# Altium schematic sheet 3-Peripheral.SchDoc
size A3; DocumentNumber: 3; SheetNumber: 3; SheetTotal: 7
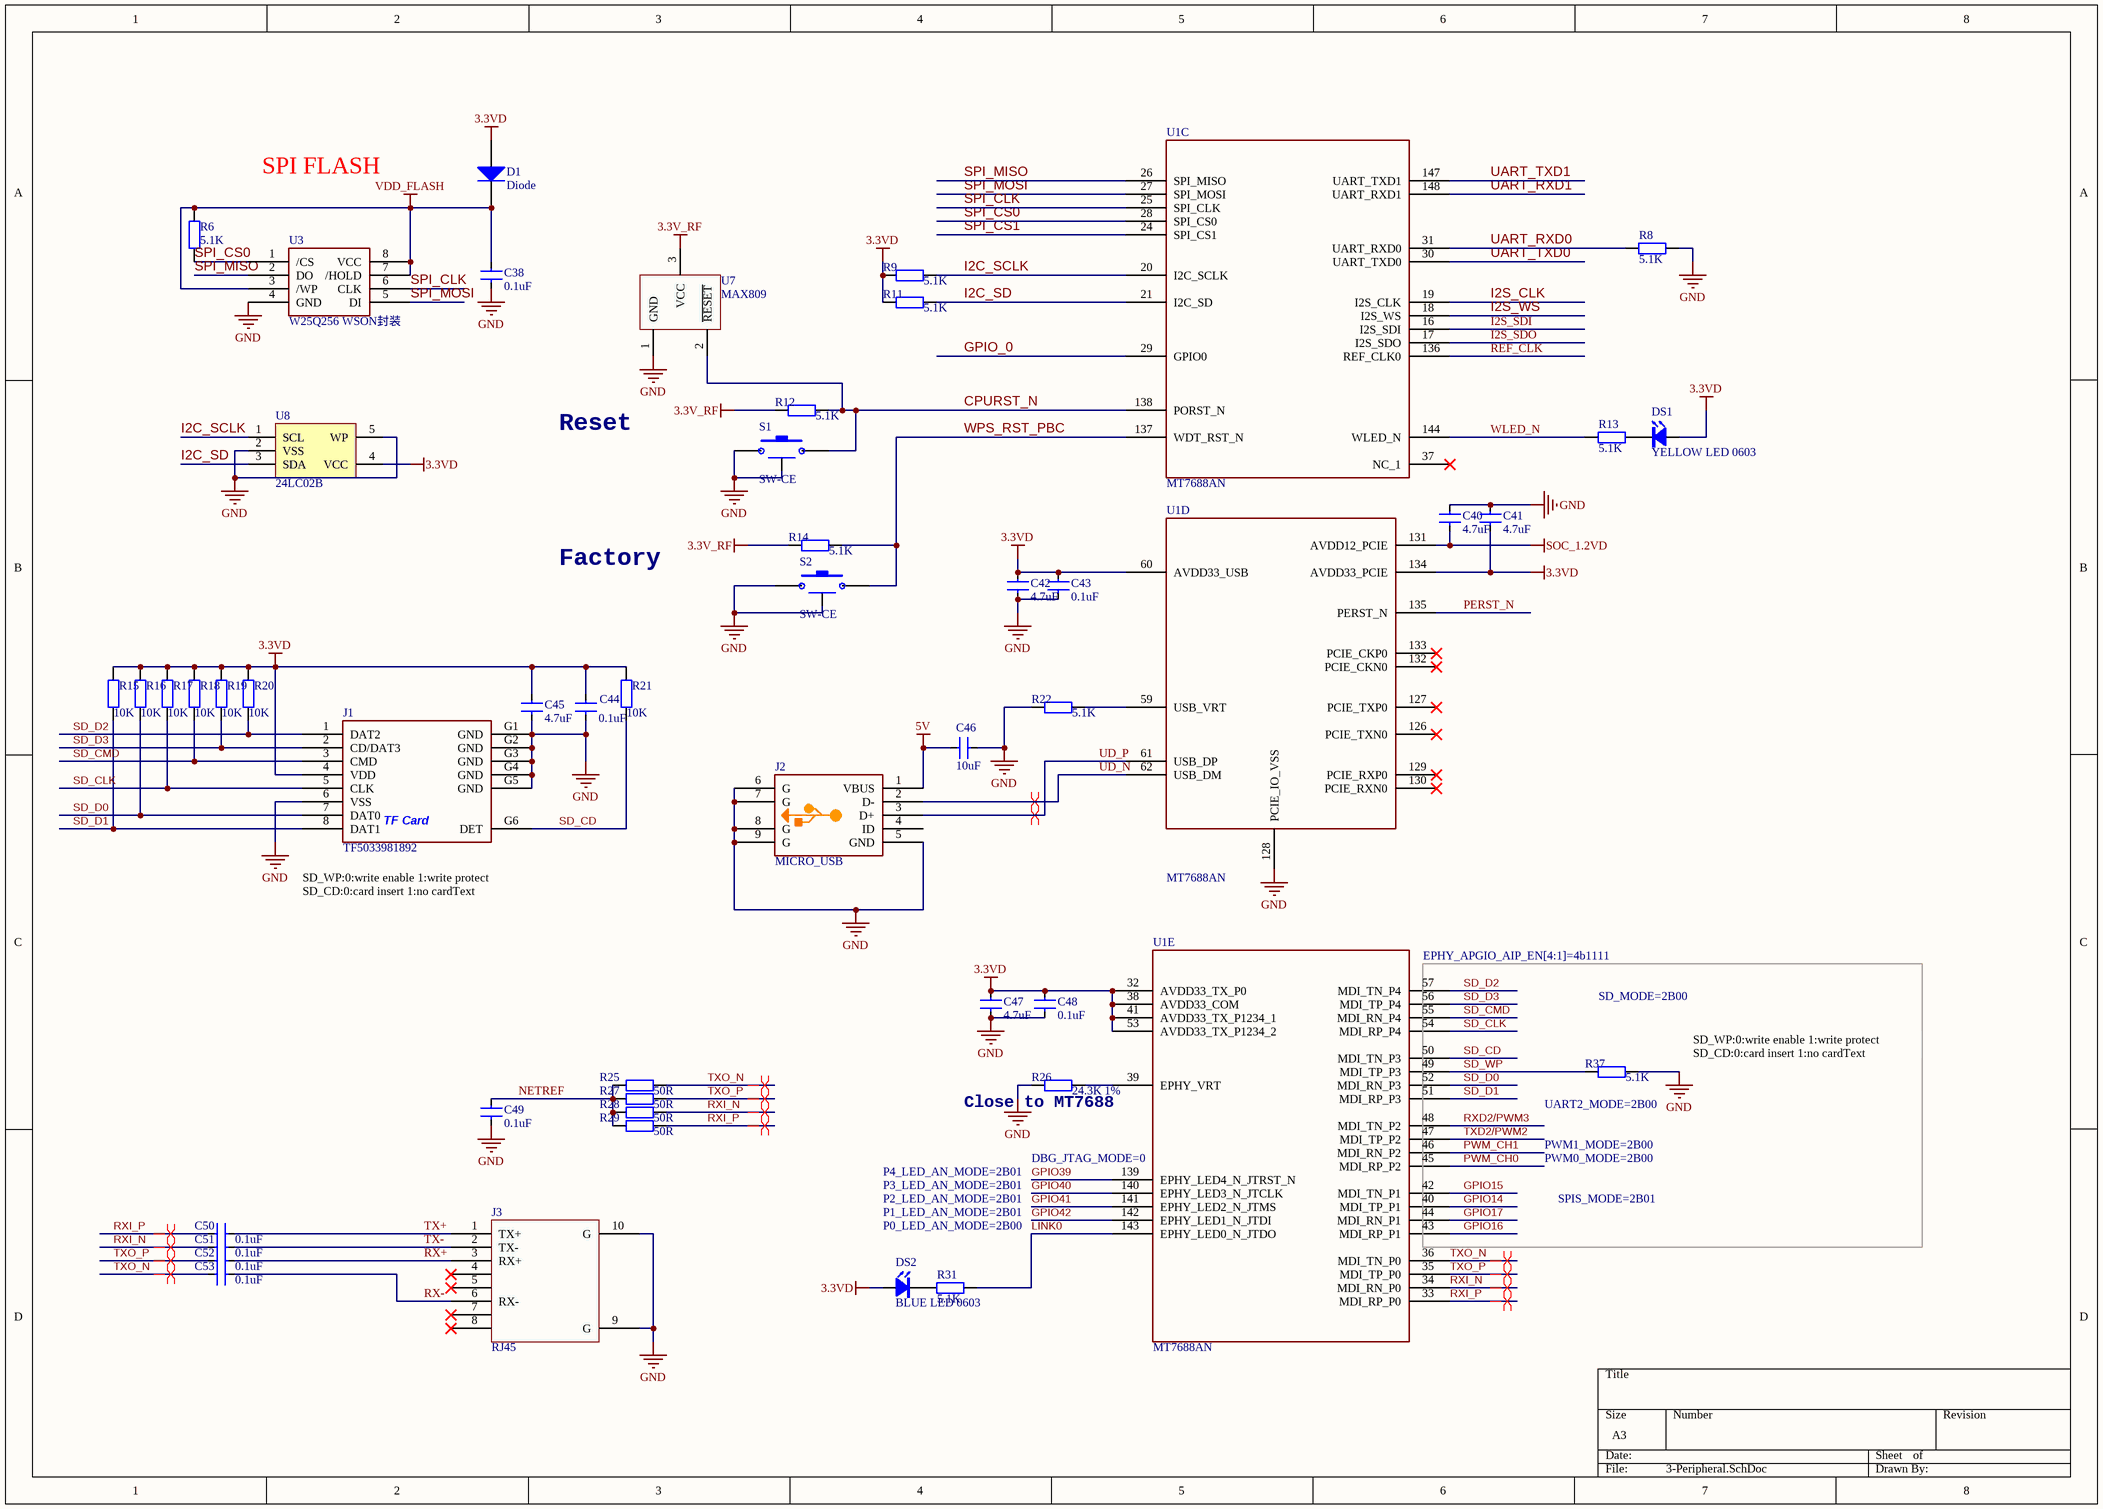
[diagram p0: 3-Peripheral.SchDoc]

## Parts
C38  0.1uF  [C0402]
C40  4.7uF  [C0402]
C41  4.7uF  [C0402]
C42  4.7uF  [C0402]
C43  0.1uF  [C0402]
C44  0.1uF  [C0402]
C45  4.7uF  [C0402]
C46  10uF  [0805C]
C47  4.7uF  [C0402]
C48  0.1uF  [C0402]
C49  0.1uF  [C0402]
C50  0.1uF  [C0402]
C51  0.1uF  [C0402]
C52  0.1uF  [C0402]
C53  0.1uF  [C0402]
D1  Diode  [SOD723]
DS1  YELLOW LED 0603  [LED0603]
DS2  BLUE LED 0603  [LED0603]
J1  TF5033981892  [TFCARD]
J2  MICRO_USB  [MICROUSB]
J3  RJ45  [RJ45]
R6  5.1K  [R0402]
R8  5.1K  [R0402]
R9  5.1K  [R0402]
R11  5.1K  [R0402]
R12  5.1K  [R0402]
R13  5.1K  [R0402]
R14  5.1K  [R0402]
R15  10K  [R0402]
R16  10K  [R0402]
R17  10K  [R0402]
R18  10K  [R0402]
R19  10K  [R0402]
R20  10K  [R0402]
R21  10K  [R0402]
R22  5.1K  [R0402]
R25  50R  [R0402]
R26  24.3K 1%  [R0402]
R27  50R  [R0402]
R28  50R  [R0402]
R29  50R  [R0402]
R31  5.1K  [R0402]
R37  5.1K  [R0402]
S1  SW-CE  [KEY-A06]
S2  SW-CE  [KEY-A06]
U1  MT7688AN  [MT7628AN/DRQFN156/SMD/P0.5/12X12]  (parts C,D,E of 6)
U3  W25Q256 WSON封装  [WSON-SPIFLASH]
U7  MAX809  [SOT23]
U8  24LC02B  [SOT23-5]

## Nets
3.3V_RF: R12.2 R14.2 U7.3(VCC)
3.3VD: C41.2 C42.1 C43.1 C44.1 C45.1 C47.1 C48.1 D1.A DS1.A DS2.A J1.4(VDD) R9.2 R11.2 R15.1 R16.1 R17.1 R18.1 R19.1 R20.1 R21.1 U1.32(AVDD33_TX_P0) U1.38(AVDD33_COM) U1.41(AVDD33_TX_P1234_1) U1.53(AVDD33_TX_P1234_2) U1.60(AVDD33_USB) U1.134(AVDD33_PCIE) U8.4(VCC)
5V: C46.1 J2.1(VBUS)
GND: C38.1 C40.1 C41.1 C42.2 C43.2 C44.2 C45.2 C46.2 C47.2 C48.2 C49.1 J1.6(VSS) J1.G1(GND) J1.G2(GND) J1.G3(GND) J1.G4(GND) J1.G5(GND) J2.5(GND) J2.6(G) J2.7(G) J2.8(G) J2.9(G) J3.9(G) J3.10(G) R8.1 R22.2 R26.2 R37.1 S1.0 S1.2 S2.0 S2.1 U1.128(PCIE_IO_VSS) U3.4(GND) U7.1(GND) U8.2(VSS) U8.5(WP)
SOC_1.2VD: C40.2 U1.131(AVDD12_PCIE)
VDD_FLASH: C38.2 D1.K R6.1 U3.3(/WP) U3.7(/HOLD) U3.8(VCC)
CPURST_N: R12.1 S1.1 U1.138(PORST_N) U7.2(~{RESET})
GPIO14: U1.40(MDI_TP_P1)
GPIO15: U1.42(MDI_TN_P1)
GPIO16: U1.43(MDI_RP_P1)
GPIO17: U1.44(MDI_RN_P1)
GPIO39: U1.139(EPHY_LED4_N_JTRST_N)
GPIO40: U1.140(EPHY_LED3_N_JTCLK)
GPIO41: U1.141(EPHY_LED2_N_JTMS)
GPIO42: U1.142(EPHY_LED1_N_JTDI)
GPIO_0: U1.29(GPIO0)
I2C_SCLK: R9.1 U1.20(I2C_SCLK) U8.1(SCL)
I2C_SD: R11.1 U1.21(I2C_SD) U8.3(SDA)
I2S_CLK: U1.19(I2S_CLK)
I2S_SDI: U1.16(I2S_SDI)
I2S_SDO: U1.17(I2S_SDO)
I2S_WS: U1.18(I2S_WS)
LINK0: R31.2 U1.143(EPHY_LED0_N_JTDO)
NETREF: C49.2 R25.2 R27.2 R28.2 R29.2
PERST_N: U1.135(PERST_N)
PWM_CH0: U1.45(MDI_RP_P2)
PWM_CH1: U1.46(MDI_RN_P2)
REF_CLK: U1.136(REF_CLK0)
RX+: C52.2 J3.3(RX+)
RX-: C53.2 J3.6(RX-)
RXD2/PWM3: U1.48(MDI_TN_P2)
RXI_N: C51.1 R28.1 U1.34(MDI_RN_P0)
RXI_P: C50.1 R29.1 U1.33(MDI_RP_P0)
SD_CD: J1.G6(DET) R21.2 U1.50(MDI_TN_P3)
SD_CLK: J1.5(CLK) R17.2 U1.54(MDI_RP_P4)
SD_CMD: J1.3(CMD) R18.2 U1.55(MDI_RN_P4)
SD_D0: J1.7(DAT0) R16.2 U1.52(MDI_RN_P3)
SD_D1: J1.8(DAT1) R15.2 U1.51(MDI_RP_P3)
SD_D2: J1.1(DAT2) R20.2 U1.57(MDI_TN_P4)
SD_D3: J1.2(CD/DAT3) R19.2 U1.56(MDI_TP_P4)
SD_WP: R37.2 U1.49(MDI_TP_P3)
SPI_CLK: U1.25(SPI_CLK) U3.6(CLK)
SPI_CS0: R6.2 U1.28(SPI_CS0) U3.1(/CS)
SPI_CS1: U1.24(SPI_CS1)
SPI_MISO: U1.26(SPI_MISO) U3.2(DO)
SPI_MOSI: U1.27(SPI_MOSI) U3.5(DI)
TX+: C50.2 J3.1(TX+)
TX-: C51.2 J3.2(TX-)
TXD2/PWM2: U1.47(MDI_TP_P2)
TXO_N: C53.1 R25.1 U1.36(MDI_TN_P0)
TXO_P: C52.1 R27.1 U1.35(MDI_TP_P0)
UART_RXD0: R8.2 U1.31(UART_RXD0)
UART_RXD1: U1.148(UART_RXD1)
UART_TXD0: U1.30(UART_TXD0)
UART_TXD1: U1.147(UART_TXD1)
UD_N: J2.2(D-) U1.62(USB_DM)
UD_P: J2.3(D+) U1.61(USB_DP)
WLED_N: R13.2 U1.144(WLED_N)
WPS_RST_PBC: R14.1 S2.2 U1.137(WDT_RST_N)
NetDS1_K: DS1.K R13.1
NetDS2_K: DS2.K R31.1
NetR22_1: R22.1 U1.59(USB_VRT)
NetR26_1: R26.1 U1.39(EPHY_VRT)

Not connected (* = marked no-connect by the designer): J2 4(ID); J3 4* 5* 7* 8*; U1 37(NC_1)* 126(PCIE_TXN0)* 127(PCIE_TXP0)* 129(PCIE_RXP0)* 130(PCIE_RXN0)* 132(PCIE_CKN0)* 133(PCIE_CKP0)*

## Layout directives
differential pair: RXI_N, RXI_P, TXO_N, TXO_P, UD_N, UD_P

## Notes on the sheet
- SPI FLASH
- Reset
- Factory
- (near J1) SD_WP:0:write enable 1:write protect
  SD_CD:0:card insert 1:no cardText
- (near U1) EPHY_APGIO_AIP_EN[4:1]=4b1111
- SD_MODE=2B00
- SD_WP:0:write enable 1:write protect
  SD_CD:0:card insert 1:no cardText
- (near R26) Close to MT7688
- (near R37) UART2_MODE=2B00
- P4_LED_AN_MODE=2B01
- P3_LED_AN_MODE=2B01
- (near U1) DBG_JTAG_MODE=0
- PWM1_MODE=2B00
- PWM0_MODE=2B00
- P0_LED_AN_MODE=2B00
- P2_LED_AN_MODE=2B01
- P1_LED_AN_MODE=2B01
- SPIS_MODE=2B01
- (in symbol TF5033981892) TF Card

## Library data of the parts
C38 C40-C53 = CAP: 普通小电容
D1 = Diode: 普通二极管
DS1 = LED: 黄色0603发光二极管
DS2 = LED: 蓝色0603发光二极管
J1 = TF5033981892: Molex TF 卡座
J3 = RJ45: RJ45不带网络变压器
R6 R8 R9 R11-R21 R25-R29 R31 = RES: 普通电阻
R22 R37 = RES: 普通电阻1%精度
U3 = SPIFLASH_SOP8W: 16MB SPIFLASH
U7 = MAX809: 2.93V复位芯片
U8 = 24LC08B